# EAGLE schematic LED-Lampe MCU (EAGLE 6.5.0)
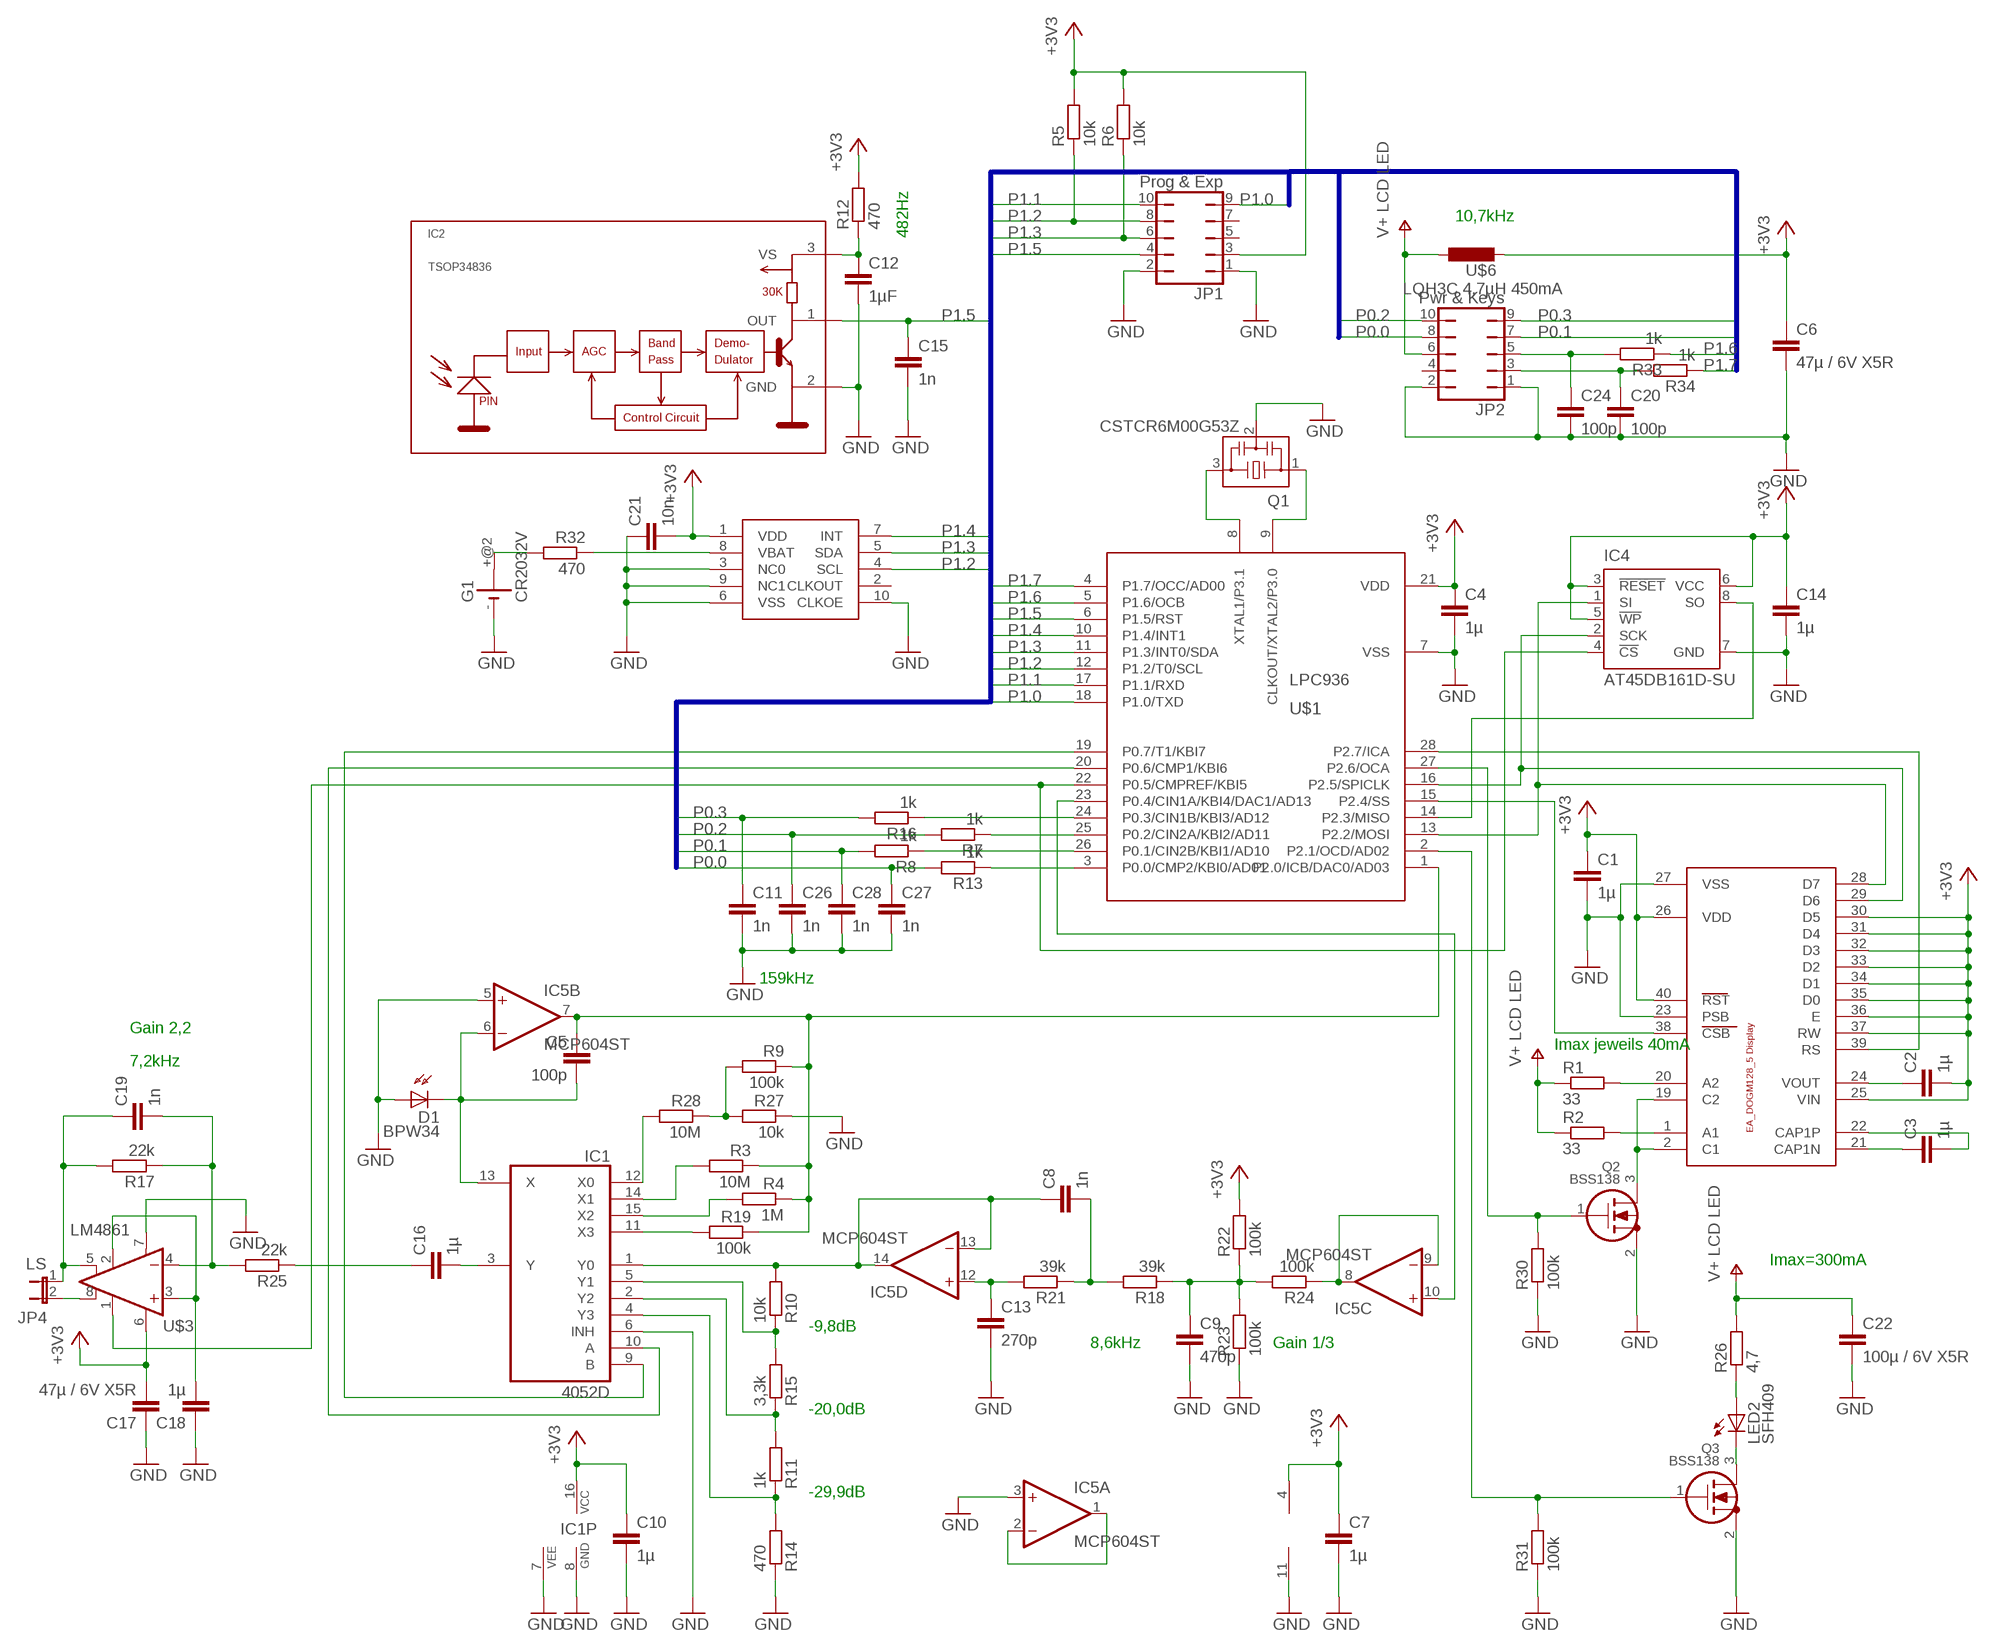
[diagram p0: schematic, sheet 1]

## Parts
C1  1µ  C-EUC0805  [C0805]
C2  1µ  C-EUC0805  [C0805]
C3  1µ  C-EUC0805  [C0805]
C4  1µ  C-EUC0805  [C0805]
C5  100p  C-EUC0603  [C0603]
C6  47µ / 6V X5R  C-EUC1206  [C1206]
C7  1µ  C-EUC0805  [C0805]
C8  1n  C-EUC0805  [C0805]
C9  470p  C-EUC0805  [C0805]
C10  1µ  C-EUC0805  [C0805]
C11  1n  C-EUC0603  [C0603]
C12  1µF  C-EUC0805  [C0805]
C13  270p  C-EUC0805  [C0805]
C14  1µ  C-EUC0805  [C0805]
C15  1n  C-EUC0603  [C0603]
C16  1µ  C-EUC1206  [C1206]
C17  47µ / 6V X5R  C-EUC1206  [C1206]
C18  1µ  C-EUC1206  [C1206]
C19  1n  C-EUC0805  [C0805]
C20  100p  C-EUC0603  [C0603]
C21  10n  C-EUC0805  [C0805]
C22  100µ / 6V X5R  C-EUC1206  [C1206]
C24  100p  C-EUC0603  [C0603]
C26  1n  C-EUC0603  [C0603]
C27  1n  C-EUC0603  [C0603]
C28  1n  C-EUC0603  [C0603]
D1  BPW34  BPW32  [BPW32]
G1  CR2032V  [CR2032V]
IC1  4052D  [SO16]
IC2  TSOP34836  [TSOP348]
IC4  AT45DB161D-SU  [8S2]
IC5  MCP604ST  [TSSOP14]
JP1  Prog & Exp  JP5Q  [JP5Q]
JP2  Pwr & Keys  JP5Q  [JP5Q]
JP4  LS  JP1E  [JP1]
LED2  SFH409  LED3MM  [LED3MM]
Q1  CSTCR6M00G53Z  [CSTCR6M]
Q2  BSS138  [SOT23]
Q3  BSS138  [SOT23]
R1  33  R-EU_R1206  [R1206]
R2  33  R-EU_R1206  [R1206]
R3  10M  R-EU_R0805  [R0805]
R4  1M  R-EU_R0805  [R0805]
R5  10k  R-EU_R0805  [R0805]
R6  10k  R-EU_R0805  [R0805]
R7  1k  R-EU_R0805  [R0805]
R8  1k  R-EU_R0805  [R0805]
R9  100k  R-EU_R0805  [R0805]
R10  10k  R-EU_R0805  [R0805]
R11  1k  R-EU_R0805  [R0805]
R12  470  R-EU_R0805  [R0805]
R13  1k  R-EU_R0805  [R0805]
R14  470  R-EU_R0805  [R0805]
R15  3,3k  R-EU_R0805  [R0805]
R16  1k  R-EU_R0805  [R0805]
R17  22k  R-EU_R0805  [R0805]
R18  39k  R-EU_R0805  [R0805]
R19  100k  R-EU_R0805  [R0805]
R21  39k  R-EU_R0805  [R0805]
R22  100k  R-EU_R0805  [R0805]
R23  100k  R-EU_R0805  [R0805]
R24  100k  R-EU_R0805  [R0805]
R25  22k  R-EU_R0805  [R0805]
R26  4,7  R-EU_R1206  [R1206]
R27  10k  R-EU_R0805  [R0805]
R28  10M  R-EU_R0805  [R0805]
R30  100k  R-EU_R0805  [R0805]
R31  100k  R-EU_R0805  [R0805]
R32  470  R-EU_R0805  [R0805]
R33  1k  R-EU_R0805  [R0805]
R34  1k  R-EU_R0805  [R0805]
U$1  LPC936  [TSSOP28]
U$2  EA_DOGM162  [E_DOG-M162]
U$3  LM4861  [SO08]
U$4  RV3029-C2  [MC_RTC]
U$6  LQH3C 4,7µH 450mA  LQH3C  [L1210]

## Nets
+3V3: C1.1 C2.2 C4.1 C6.1 C7.1 C10.1 C14.1 C17.2 C21.2 IC1.16(VCC) IC4.3(!RESET) IC4.5(!WP) IC4.6(VCC) IC5.4(P:V+) JP1.3 R5.2 R6.2 R12.2 R22.2 U$1.21(VDD) U$2.25(VIN) U$2.26(VDD) U$2.30(D5) U$2.31(D4) U$2.32(D3) U$2.33(D2) U$2.34(D1) U$2.35(D0) U$2.36(E) U$2.37(RW) U$2.40(RST) U$3.6(VDD) U$4.1(VDD) U$6.2
GND: C1.2 C4.2 C6.2 C7.2 C9.2 C10.2 C11.2 C12.2 C13.2 C14.2 C15.2 C17.1 C18.1 C20.2 C21.1 C22.2 C24.2 C26.2 C27.2 C28.2 D1.A G1.- IC1.6(INH) IC1.7(VEE) IC1.8(GND) IC2.2(GND) IC4.7(GND) IC5.3(A:+IN) IC5.5(B:+IN) IC5.11(P:V-) JP1.1 JP1.2 JP2.1 JP2.2 Q1.2 Q2.2(S) Q3.2(S) R14.1 R23.1 R27.1 R30.1 R31.1 U$1.7(VSS) U$2.23(PSB) U$2.27(VSS) U$3.7(GND) U$4.3(NC0) U$4.6(VSS) U$4.9(NC1) U$4.10(CLKOE)
N$1: C2.1 U$2.24(VOUT)
N$2: IC1.9(B) U$1.19(P0.7/T1/KBI7)
N$3: C3.2 U$2.22(CAP1P)
N$4: C3.1 U$2.21(CAP1N)
N$5: U$1.15(P2.4/SS) U$2.38(CSB)
N$6: C12.1 IC2.3(VS) R12.1
N$7: R1.2 U$2.20(A2)
N$8: R2.2 U$2.1(A1)
N$9: IC4.2(SCK) U$1.16(P2.5/SPICLK) U$2.29(D6)
N$10: IC4.1(SI) U$1.13(P2.2/MOSI) U$2.28(D7)
N$11: Q2.1(G) R30.2 U$1.27(P2.6/OCA)
N$12: IC1.10(A) U$1.20(P0.6/CMP1/KBI6)
N$13: U$1.28(P2.7/ICA) U$2.39(RS)
N$14: Q1.3 U$1.8(XTAL1/P3.1)
N$15: Q1.1 U$1.9(CLKOUT/XTAL2/P3.0)
N$16: Q2.3(D) U$2.2(C1) U$2.19(C2)
N$17: R8.1 U$1.26(P0.1/CIN2B/KBI1/AD10)
N$18: JP4.2 U$3.8(VO2)
N$19: R16.1 U$1.24(P0.3/CIN1B/KBI3/AD12)
N$20: R13.1 U$1.3(P0.0/CMP2/KBI0/AD01)
N$21: C18.2 U$3.2(BYPASS) U$3.3(+IN)
N$22: R7.1 U$1.25(P0.2/CIN2A/KBI2/AD11)
N$23: IC4.8(SO) U$1.14(P2.3/MISO)
N$25: IC1.4(Y3) R11.1 R14.2
N$26: IC1.2(Y2) R11.2 R15.1
N$27: IC1.5(Y1) R10.1 R15.2
N$28: C8.1 IC1.1(Y0) IC5.13(D:-IN) IC5.14(D:OUT) R10.2
N$29: C13.1 IC5.12(D:+IN) R21.2
N$30: C8.2 R18.2 R21.1
N$31: LED2.A R26.1
N$32: IC5.10(C:+IN) U$1.23(P0.4/CIN1A/KBI4/DAC1/AD13)
N$33: C5.2 D1.K(C) IC1.13(X) IC5.6(B:-IN)
N$34: C5.1 IC5.7(B:OUT) R3.1 R4.1 R9.1 R19.1 U$1.1(P2.0/ICB/DAC0/AD03)
N$35: IC1.11(X3) R19.2
N$36: C9.1 R18.1 R22.1 R23.2 R24.2
N$37: Q3.1(G) R31.2 U$1.2(P2.1/OCD/AD02)
N$38: IC1.15(X2) R4.2
N$39: IC1.14(X1) R3.2
N$40: IC1.12(X0) R28.2
N$41: C19.2 R17.1 R25.2 U$3.4(-IN)
N$42: C16.1 R25.1
N$44: C16.2 IC1.3(Y)
N$45: C19.1 JP4.1 R17.2 U$3.5(VO1)
N$46: LED2.K(C) Q3.3(D)
N$47: IC4.4(!CS) U$1.22(P0.5/CMPREF/KBI5) U$3.1(SHUTDOWN)
N$49: R32.1 U$4.8(VBAT)
N$50: R9.2 R27.2 R28.1
N$51: IC5.8(C:OUT) IC5.9(C:-IN) R24.1
N$52: G1.+@2(+) R32.2
N$53: IC5.1(A:OUT) IC5.2(A:-IN)
N$55: C24.1 JP2.5 R33.2
N$56: C20.1 JP2.3 R34.2
P0.0: C27.1 JP2.8 R13.2
P0.1: C28.1 JP2.7 R8.2
P0.2: C26.1 JP2.10 R7.2
P0.3: C11.1 JP2.9 R16.2
P1.0: JP1.9 U$1.18(P1.0/TXD)
P1.1: JP1.10 U$1.17(P1.1/RXD)
P1.2: JP1.8 R5.1 U$1.12(P1.2/T0/SCL) U$4.4(SCL)
P1.3: JP1.6 R6.1 U$1.11(P1.3/INT0/SDA) U$4.5(SDA)
P1.4: U$1.10(P1.4/INT1) U$4.7(INT)
P1.5: C15.1 IC2.1(OUT) JP1.4 U$1.6(P1.5/RST)
P1.6: R33.1 U$1.5(P1.6/OCB)
P1.7: R34.1 U$1.4(P1.7/OCC/AD00)
V+: C22.1 JP2.6 R1.1 R2.1 R26.2 U$6.1 ; supply symbol labelled V+ LCD LED
Unconnected: G1.+ JP1.5 JP1.7 JP2.4 U$4.2(CLKOUT)

## Buses
P1.[0..7],P0.[0..7]

## Notes on the sheet
- 10,7kHz
- 482Hz
- 159kHz
- Gain 2,2
- Imax jeweils 40mA
- 7,2kHz
- Imax=300mA
- -9,8dB
- 8,6kHz | Gain 1/3
- -20,0dB
- -29,9dB

## Library data of the parts
C1-C5 C7-C21 C24 C26-C28 = rcl:C-EU: CAPACITOR, European symbol
C6 C22 = resistor:C-EU: CAPACITOR, European symbol
D1 = opto-trans-siemens:BPW32: PHOTO DIODE; OC_FARNELL: unknown; OC_NEWARK: unknown
G1 = battery:CR2032V: LI BATTERY Varta
IC1 = 40xx:4052: Dual 4-channel ANALOG MULTIPLEXER
IC2 = vishay-1:TSOP348*: IR Receiver Modules for Remote Control Systems http://www.vishay.com/ir-receiver-modules/
IC4 = atmel:AT45DB161D: 16-megabit 2.5V or 2.7V DataFlash Source: http://www.atmel.com/dyn/resources/prod_documents/doc3500.pdf; MF: ATMEL; MPN: AT45DB161D-SU; OC_FARNELL: 1455040
IC5 = linear:MCP604: Quad Op Amp 2.7V to 6.0V Single Supply CMOS Source: http://ww1.microchip.com/downloads/en/DeviceDoc/21314g.pdf
JP1 JP2 = jumper:JP5Q: JUMPER
JP4 = jumper:JP1E: JUMPER
LED2 = led:LED: LED OSRAM: - CHIPLED LG R971, LG N971, LY N971, LG Q971, LY Q971, LO R971, LY R971 LH N974, LH R974 LS Q976, LO Q976, LY Q976 LO Q996 - Hyper CHIPLED LW Q18S LB Q993, LB Q99A, LB R99A - SideLED LS A670, LO A670, LY A670, LG A670, LP A670 LB A673, LV A673, LT A673, LW A673 LH A674 LY A675 LS A676, LA A676, LO A676, LY A676, LW A676 LS A679, LY A679, LG A679 - Hyper Micro SIDELED® LS Y876, LA Y876, LO Y876, LY Y876 LT Y87S - SmartLED LW L88C, LW L88S LB L89C, LB L89S, LG L890 LS L89K, LO L89K, LY L89K LS L896, LA L896, LO L896, LY L896 - TOPLED LS T670, LO T670, LY T670, LG T670, LP T670 LSG T670, LSP T670, LSY T670, LOP T670, LYG T670 LG T671, LOG T671, LSG T671 LB T673, LV T673, LT T673, LW T673 LH T674 LS T676, LA T676, LO T676, LY T676, LB T676, LH T676, LSB T676, LW T676 LB T67C, LV T67C, LT T67C, LS T67K, LO T67K, LY T67K, LW E67C LS E67B, LA E67B, LO E67B, LY E67B, LB E67C, LV E67C, LT E67C LW T67C LS T679, LY T679, LG T679 LS T770, LO T770, LY T770, LG T770, LP T770 LB T773, LV T773, LT T773, LW T773 LH T774 LS E675, LA E675, LY E675, LS T675 LS T776, LA T776, LO T776, LY T776, LB T776 LHGB T686 LT T68C, LB T68C - Hyper Mini TOPLED® LB M676 - Mini TOPLED Santana® LG M470 LS M47K, LO M47K, LY M47K Source: http://www.osram.convergy.de LUXEON: - LUMILED® LXK2-PW12-R00, LXK2-PW12-S00, LXK2-PW14-U00, LXK2-PW14-V00 LXK2-PM12-R00, LXK2-PM12-S00, LXK2-PM14-U00 LXK2-PE12-Q00, LXK2-PE12-R00, LXK2-PE12-S00, LXK2-PE14-T00, LXK2-PE14-U00 LXK2-PB12-K00, LXK2-PB12-L00, LXK2-PB12-M00, LXK2-PB14-N00, LXK2-PB14-P00, LXK2-PB14-Q00 LXK2-PR12-L00, LXK2-PR12-M00, LXK2-PR14-Q00, LXK2-PR14-R00 LXK2-PD12-Q00, LXK2-PD12-R00, LXK2-PD12-S00 LXK2-PH12-R00, LXK2-PH12-S00 LXK2-PL12-P00, LXK2-PL12-Q00, LXK2-PL12-R00 Source: www.luxeon.com KINGBRIGHT: KA-3528ASYC Source: www.kingbright.com
Q1 = murata-filter:CSTCR: Resonator Source: murata.co.jp; MPN: CSTCR6M00G53-R0; OC_FARNELL: 1170434; OC_NEWARK: 25M8759
Q2 Q3 = transistors:BSS138: BSS138: N-channel enhancement MOSFET (ON Semiconductor) 50V Uds, 200mA Id, 225mW Ptot, 3.5Ω Rdson
R1 R2 R5-R8 R12 R13 R16 R17 R25 R26 R30 R31 R33 R34 = rcl:R-EU_: RESISTOR, European symbol
R3 R4 R9-R11 R14 R15 R18 R19 R21-R24 R27 R28 R32 = resistor:R-EU_: RESISTOR, European symbol
U$1 = nxp:LPC936
U$2 = display_ea_dog:EA_DOGM162
U$3 = LM4861:LM4861
U$4 = MicroCrystal:RV3029-C2
U$6 = mcl:LQH3C: muRata Chip Coil LQH3C